# EasyEDA schematic Thru-hole.json
TITLE: Sheet_2; REV: 1.0; Date: 2021-08-04; Sheet: 1/1; Drawn By: roberttco; Company: Your Company
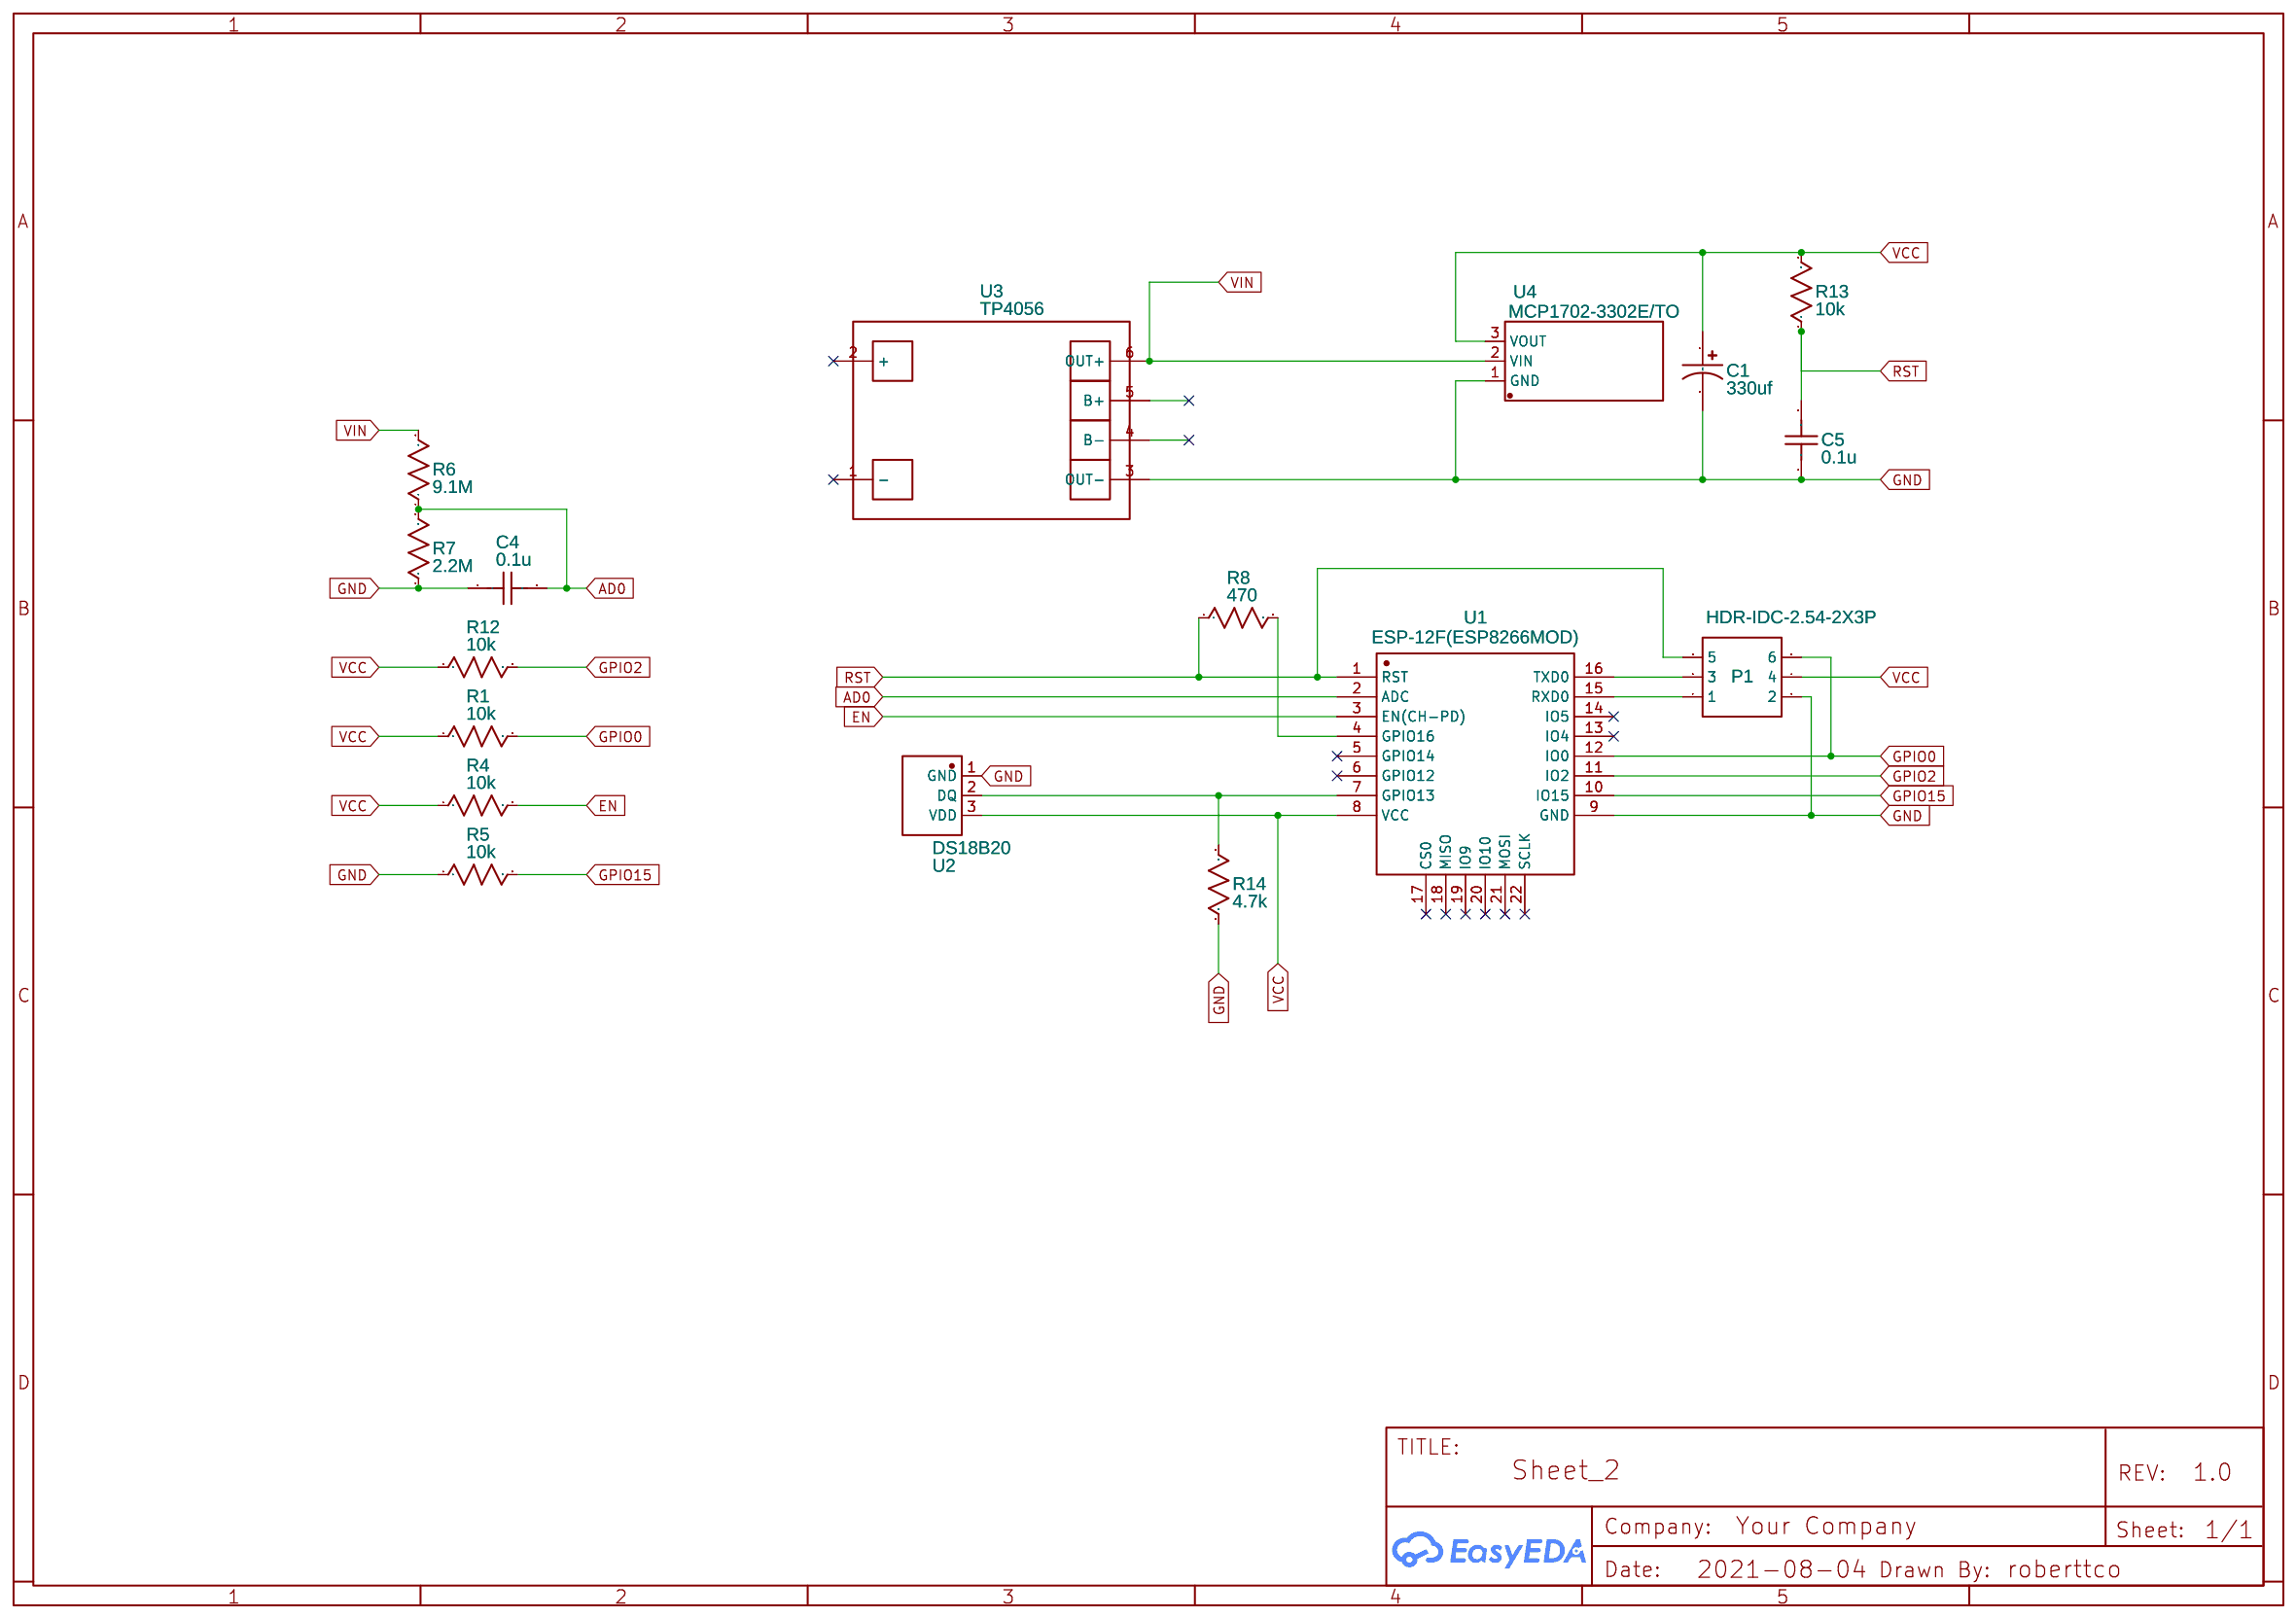
[diagram p0: schematic sheet]

## Parts
C1  330uf  [CAP-TH_BD8.0-P2.50-D1.0-FD]
C4  0.1u  [CAP-TH_L4.0-W2.5-P5.00-1.2]
C5  0.1u  [CAP-TH_L4.0-W2.5-P5.00-1.2]
P1  HDR-IDC-2.54-2X3P  [3X2_2.54]
R1  10k  [RES-TH_BD1.7-L3.5-P7.50-D0.5]
R4  10k  [RES-TH_BD1.7-L3.5-P7.50-D0.5]
R5  10k  [RES-TH_BD1.7-L3.5-P7.50-D0.5]
R6  9.1M  [RES-TH_BD1.7-L3.5-P7.50-D0.5]
R7  2.2M  [RES-TH_BD1.7-L3.5-P7.50-D0.5]
R8  470  [RES-TH_BD1.7-L3.5-P7.50-D0.5]
R12  10k  [RES-TH_BD1.7-L3.5-P7.50-D0.5]
R13  10k  [RES-TH_BD1.7-L3.5-P7.50-D0.5]
R14  4.7k  [RES-TH_BD1.7-L3.5-P7.50-D0.5]
U1  ESP-12F(ESP8266MOD)  [WIFIM-SMD_ESP-12F-ESP8266MOD]
U2  DS18B20  [TO-92-3_L4.9-W3.7-P1.27-L]
U3  TP4056  [TP4056]
U4  MCP1702-3302E/TO  [TO-92-3_L4.9-W3.7-P1.27-L]

## Library data of the parts
C1 = C_Tan_SMD_A_US: Supplier: Seeed Tech OLP; Contributor: LCEDA_Lib
C4 C5 = C_0603_US: Supplier: Seeed Tech OLP; Contributor: LCEDA_Lib; Manufacturer Part: GRM155R71C104KA88D
P1 = HDR-IDC-2.54-2X3P: Package Display: No
R1 R4-R8 R12-R14 = R_0603_US: Supplier: Seeed Tech OLP; Contributor: LCEDA_Lib
U1 = ESP-12F(ESP8266MOD): Supplier: LCSC; Manufacturer: Ai-Thinker; Supplier Part: C82891; JLCPCB Part Class: Extended Part; Package Display: No
U2 = DS18B20: Contributor: LCSC; Package Display: No
U3 = TP4056: Contributor: randy.kamarga; Package Display: No
U4 = MCP1702-3302E/TO: Supplier: LCSC; Supplier Part: C220654; Manufacturer: Microchip Tech; Contributor: LCSC; JLCPCB Part Class: Extended Part

## Nets
GND: C1.2 C4.1 C5.1 P1.2 R5.1 R7.1 R14.1 U1.9(GND) U2.1(GND) U3.3(OUT-) U4.1(GND)
VCC: C1.1 P1.4 R1.1 R4.1 R12.1 R13.2 U1.8(VCC) U2.3(VDD) U4.3(VOUT)
VIN: R6.2 U3.6(OUT+) U4.2(VIN)
AD0: C4.2 R6.1 R7.2 U1.2(ADC)
EN: R4.2 U1.3(EN(CH-PD))
GPIO0: P1.6 R1.2 U1.12(IO0)
GPIO2: R12.2 U1.11(IO2)
GPIO15: R5.2 U1.10(IO15)
RST: C5.2 P1.5 R8.1 R13.1 U1.1(RST)
Net-(P1-1): P1.1 U1.15(RXD0)
Net-(P1-3): P1.3 U1.16(TXD0)
Net-(R8-2): R8.2 U1.4(GPIO16)
Net-(R14-2): R14.2 U1.7(GPIO13) U2.2(DQ)

Not connected (* = marked no-connect by the designer): U1 5(GPIO14)* 6(GPIO12)* 13(IO4)* 14(IO5)* 17(CS0)* 18(MISO)* 19(IO9)* 20(IO10)* 21(MOSI)* 22(SCLK)*; U3 1(-)* 2(+)* 4(B-) 5(B+)
